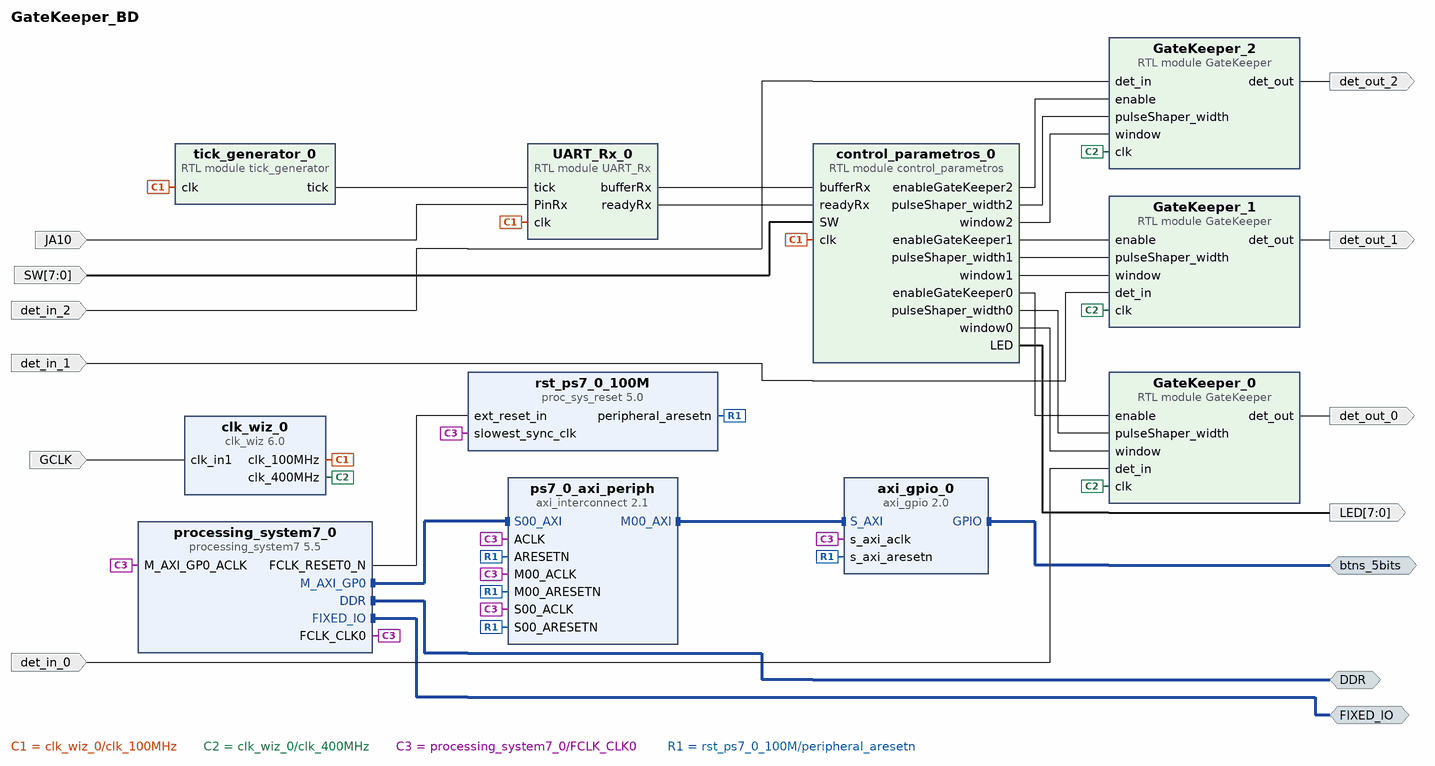
[diagram p0: block diagram of the top level]
# Vivado block design GateKeeper_BD, xc7z020clg484-1, Vivado 2023.2
create_bd_design GateKeeper_BD

create_bd_intf_port -mode Master -vlnv xilinx.com:interface:ddrx_rtl:1.0 DDR
create_bd_intf_port -mode Master -vlnv xilinx.com:display_processing_system7:fixedio_rtl:1.0 FIXED_IO
create_bd_intf_port -mode Master -vlnv xilinx.com:interface:gpio_rtl:1.0 btns_5bits
create_bd_port -dir I -type clk GCLK
set_property -dict {CONFIG.FREQ_HZ 100000000} [get_bd_ports GCLK]
create_bd_port -dir I -type data JA10
create_bd_port -dir I -type data det_in_1
create_bd_port -dir I -type data det_in_2
create_bd_port -dir I -type data det_in_0
create_bd_port -dir O -type data det_out_0
create_bd_port -dir O -type data det_out_1
create_bd_port -dir O -type data det_out_2
create_bd_port -dir O -from 7 -to 0 -type data LED
create_bd_port -dir I -from 7 -to 0 -type data SW

create_bd_cell -type module -reference GateKeeper GateKeeper_0
create_bd_cell -type module -reference GateKeeper GateKeeper_1
create_bd_cell -type module -reference GateKeeper GateKeeper_2
create_bd_cell -type module -reference tick_generator tick_generator_0
create_bd_cell -type module -reference UART_Rx UART_Rx_0
create_bd_cell -type ip -vlnv xilinx.com:ip:clk_wiz:6.0 clk_wiz_0
set_property -dict [list \
  CONFIG.CLKOUT1_DRIVES BUFG \
  CONFIG.CLKOUT1_JITTER 144.719 \
  CONFIG.CLKOUT1_PHASE_ERROR 114.212 \
  CONFIG.CLKOUT2_DRIVES BUFG \
  CONFIG.CLKOUT2_JITTER 111.164 \
  CONFIG.CLKOUT2_PHASE_ERROR 114.212 \
  CONFIG.CLKOUT2_REQUESTED_OUT_FREQ 400.000 \
  CONFIG.CLKOUT2_USED true \
  CONFIG.CLKOUT3_DRIVES BUFG \
  CONFIG.CLKOUT4_DRIVES BUFG \
  CONFIG.CLKOUT5_DRIVES BUFG \
  CONFIG.CLKOUT6_DRIVES BUFG \
  CONFIG.CLKOUT7_DRIVES BUFG \
  CONFIG.CLK_OUT1_PORT clk_100MHz \
  CONFIG.CLK_OUT2_PORT clk_400MHz \
  CONFIG.FEEDBACK_SOURCE FDBK_AUTO \
  CONFIG.JITTER_SEL Min_O_Jitter \
  CONFIG.MMCM_BANDWIDTH HIGH \
  CONFIG.MMCM_CLKFBOUT_MULT_F 8.000 \
  CONFIG.MMCM_CLKOUT0_DIVIDE_F 8.000 \
  CONFIG.MMCM_CLKOUT1_DIVIDE 2 \
  CONFIG.MMCM_COMPENSATION ZHOLD \
  CONFIG.NUM_OUT_CLKS 2 \
  CONFIG.PRIMITIVE MMCM \
  CONFIG.USE_LOCKED false \
  CONFIG.USE_RESET false \
] [get_bd_cells clk_wiz_0]
create_bd_cell -type ip -vlnv xilinx.com:ip:processing_system7:5.5 processing_system7_0
set_property -dict [list \
  CONFIG.PCW_APU_PERIPHERAL_FREQMHZ 666.666667 \
  CONFIG.PCW_ENET0_ENET0_IO {MIO 16 .. 27} \
  CONFIG.PCW_ENET0_GRP_MDIO_ENABLE 1 \
  CONFIG.PCW_ENET0_GRP_MDIO_IO {MIO 52 .. 53} \
  CONFIG.PCW_ENET0_PERIPHERAL_ENABLE 1 \
  CONFIG.PCW_ENET0_RESET_ENABLE 0 \
  CONFIG.PCW_ENET_RESET_ENABLE 1 \
  CONFIG.PCW_ENET_RESET_SELECT {Share reset pin} \
  CONFIG.PCW_FPGA0_PERIPHERAL_FREQMHZ 100.000000 \
  CONFIG.PCW_FPGA1_PERIPHERAL_FREQMHZ 150.000000 \
  CONFIG.PCW_FPGA2_PERIPHERAL_FREQMHZ 50.000000 \
  CONFIG.PCW_GPIO_MIO_GPIO_ENABLE 1 \
  CONFIG.PCW_GPIO_MIO_GPIO_IO MIO \
  CONFIG.PCW_I2C_RESET_ENABLE 1 \
  CONFIG.PCW_PRESET_BANK1_VOLTAGE {LVCMOS 1.8V} \
  CONFIG.PCW_QSPI_GRP_SINGLE_SS_ENABLE 1 \
  CONFIG.PCW_QSPI_GRP_SINGLE_SS_IO {MIO 1 .. 6} \
  CONFIG.PCW_QSPI_PERIPHERAL_ENABLE 1 \
  CONFIG.PCW_QSPI_PERIPHERAL_FREQMHZ 200.000000 \
  CONFIG.PCW_QSPI_QSPI_IO {MIO 1 .. 6} \
  CONFIG.PCW_SD0_GRP_CD_ENABLE 1 \
  CONFIG.PCW_SD0_GRP_CD_IO {MIO 47} \
  CONFIG.PCW_SD0_GRP_WP_ENABLE 1 \
  CONFIG.PCW_SD0_GRP_WP_IO {MIO 46} \
  CONFIG.PCW_SD0_PERIPHERAL_ENABLE 1 \
  CONFIG.PCW_SD0_SD0_IO {MIO 40 .. 45} \
  CONFIG.PCW_SDIO_PERIPHERAL_FREQMHZ 50 \
  CONFIG.PCW_SINGLE_QSPI_DATA_MODE x4 \
  CONFIG.PCW_TTC0_PERIPHERAL_ENABLE 1 \
  CONFIG.PCW_TTC0_TTC0_IO EMIO \
  CONFIG.PCW_UART1_PERIPHERAL_ENABLE 1 \
  CONFIG.PCW_UART1_UART1_IO {MIO 48 .. 49} \
  CONFIG.PCW_UART_PERIPHERAL_FREQMHZ 50 \
  CONFIG.PCW_UIPARAM_DDR_FREQ_MHZ 533.333313 \
  CONFIG.PCW_UIPARAM_DDR_PARTNO {MT41J128M16 HA-15E} \
  CONFIG.PCW_USB0_PERIPHERAL_ENABLE 1 \
  CONFIG.PCW_USB0_RESET_ENABLE 0 \
  CONFIG.PCW_USB0_USB0_IO {MIO 28 .. 39} \
  CONFIG.PCW_USB_RESET_ENABLE 1 \
  CONFIG.PCW_USB_RESET_SELECT {Share reset pin} \
  CONFIG.preset ZedBoard \
] [get_bd_cells processing_system7_0]
# 221 more settings of processing_system7_0 are not shown: defaults, MIO pin electricals, DDR timing, and values the tool derives
create_bd_cell -type ip -vlnv xilinx.com:ip:axi_gpio:2.0 axi_gpio_0
set_property -dict {CONFIG.GPIO_BOARD_INTERFACE btns_5bits CONFIG.USE_BOARD_FLOW true} [get_bd_cells axi_gpio_0]
create_bd_cell -type ip -vlnv xilinx.com:ip:axi_interconnect:2.1 ps7_0_axi_periph
set_property -dict {CONFIG.NUM_MI 1} [get_bd_cells ps7_0_axi_periph]
create_bd_cell -type ip -vlnv xilinx.com:ip:proc_sys_reset:5.0 rst_ps7_0_100M
create_bd_cell -type module -reference control_parametros control_parametros_0

# ---- connections ----

connect_bd_intf_net [get_bd_intf_ports btns_5bits] [get_bd_intf_pins axi_gpio_0/GPIO]
connect_bd_intf_net [get_bd_intf_ports DDR] [get_bd_intf_pins processing_system7_0/DDR]
connect_bd_intf_net [get_bd_intf_ports FIXED_IO] [get_bd_intf_pins processing_system7_0/FIXED_IO]
connect_bd_intf_net [get_bd_intf_pins processing_system7_0/M_AXI_GP0] [get_bd_intf_pins ps7_0_axi_periph/S00_AXI]
connect_bd_intf_net [get_bd_intf_pins ps7_0_axi_periph/M00_AXI] [get_bd_intf_pins axi_gpio_0/S_AXI]
connect_bd_net [get_bd_ports GCLK] [get_bd_pins clk_wiz_0/clk_in1]
connect_bd_net [get_bd_pins GateKeeper_0/det_out] [get_bd_ports det_out_0]
connect_bd_net [get_bd_pins GateKeeper_1/det_out] [get_bd_ports det_out_1]
connect_bd_net [get_bd_pins GateKeeper_2/det_out] [get_bd_ports det_out_2]
connect_bd_net -net JA10_1 [get_bd_ports JA10] [get_bd_pins UART_Rx_0/PinRx]
connect_bd_net [get_bd_ports SW] [get_bd_pins control_parametros_0/SW]
connect_bd_net [get_bd_pins UART_Rx_0/bufferRx] [get_bd_pins control_parametros_0/bufferRx]
connect_bd_net [get_bd_pins UART_Rx_0/readyRx] [get_bd_pins control_parametros_0/readyRx]
connect_bd_net [get_bd_pins clk_wiz_0/clk_100MHz] \
  [get_bd_pins UART_Rx_0/clk] [get_bd_pins tick_generator_0/clk] [get_bd_pins control_parametros_0/clk]
connect_bd_net [get_bd_pins clk_wiz_0/clk_400MHz] [get_bd_pins GateKeeper_0/clk] [get_bd_pins GateKeeper_1/clk] [get_bd_pins GateKeeper_2/clk]
connect_bd_net [get_bd_pins control_parametros_0/LED] [get_bd_ports LED]
connect_bd_net [get_bd_pins control_parametros_0/enableGateKeeper0] [get_bd_pins GateKeeper_0/enable]
connect_bd_net [get_bd_pins control_parametros_0/enableGateKeeper1] [get_bd_pins GateKeeper_1/enable]
connect_bd_net [get_bd_pins control_parametros_0/enableGateKeeper2] [get_bd_pins GateKeeper_2/enable]
connect_bd_net [get_bd_pins control_parametros_0/pulseShaper_width0] [get_bd_pins GateKeeper_0/pulseShaper_width]
connect_bd_net [get_bd_pins control_parametros_0/pulseShaper_width1] [get_bd_pins GateKeeper_1/pulseShaper_width]
connect_bd_net [get_bd_pins control_parametros_0/pulseShaper_width2] [get_bd_pins GateKeeper_2/pulseShaper_width]
connect_bd_net [get_bd_pins control_parametros_0/window0] [get_bd_pins GateKeeper_0/window]
connect_bd_net [get_bd_pins control_parametros_0/window1] [get_bd_pins GateKeeper_1/window]
connect_bd_net [get_bd_pins control_parametros_0/window2] [get_bd_pins GateKeeper_2/window]
connect_bd_net -net det_in_0_1 [get_bd_ports det_in_0] [get_bd_pins GateKeeper_0/det_in]
connect_bd_net -net det_in_1_1 [get_bd_ports det_in_1] [get_bd_pins GateKeeper_1/det_in]
connect_bd_net -net det_in_2_1 [get_bd_ports det_in_2] [get_bd_pins GateKeeper_2/det_in]
connect_bd_net [get_bd_pins processing_system7_0/FCLK_CLK0] \
  [get_bd_pins processing_system7_0/M_AXI_GP0_ACLK] [get_bd_pins ps7_0_axi_periph/S00_ACLK] \
  [get_bd_pins rst_ps7_0_100M/slowest_sync_clk] [get_bd_pins axi_gpio_0/s_axi_aclk] [get_bd_pins ps7_0_axi_periph/M00_ACLK] \
  [get_bd_pins ps7_0_axi_periph/ACLK]
connect_bd_net [get_bd_pins processing_system7_0/FCLK_RESET0_N] [get_bd_pins rst_ps7_0_100M/ext_reset_in]
connect_bd_net [get_bd_pins rst_ps7_0_100M/peripheral_aresetn] \
  [get_bd_pins ps7_0_axi_periph/S00_ARESETN] [get_bd_pins axi_gpio_0/s_axi_aresetn] \
  [get_bd_pins ps7_0_axi_periph/M00_ARESETN] [get_bd_pins ps7_0_axi_periph/ARESETN]
connect_bd_net [get_bd_pins tick_generator_0/tick] [get_bd_pins UART_Rx_0/tick]

# ---- address map ----
assign_bd_address -offset 0x41200000 -range 64K -target_address_space [get_bd_addr_spaces processing_system7_0/Data] [get_bd_addr_segs axi_gpio_0/S_AXI/Reg]

validate_bd_design
save_bd_design
